# Altium schematic sheet QUTMS-TSAL2-S01.SchDoc: LED Driver
size A3; DrawnBy: Joseph Richards; DocumentNumber: 2; Revision: 2; SheetNumber: 3; SheetTotal: 3
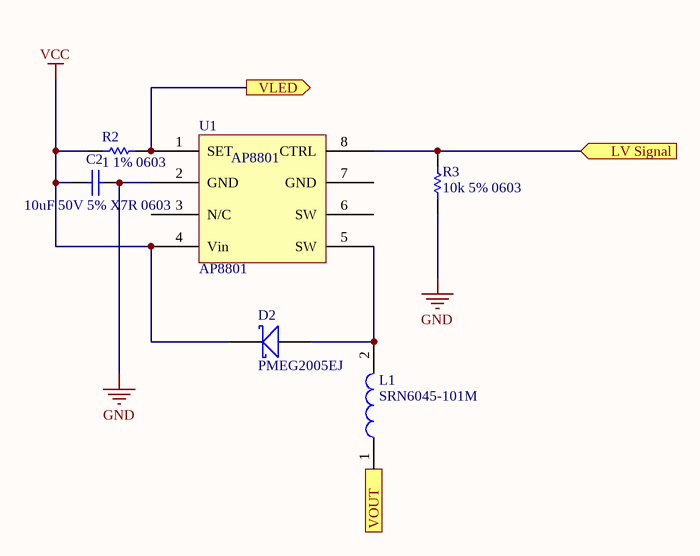
[diagram p0: QUTMS-TSAL2-S01.SchDoc]

## Parts
C2  10uF 50V 5% X7R 0603  [Cap_Ceramic_0603(10uf)]
D2  PMEG2005EJ  [SOD-323F(shottkey)]
L1  SRN6045-101M  [Bourns Inductor 6x6x4.5mm(100mH)]
R2  1 1% 0603  [Res_ThinFilm_0603 (1,10k)]
R3  10k 5% 0603  [Res_ThinFilm_0603 (1,10k)]
U1  AP8801  [SOP8/SO8(AP8801)]

## Ports
LV Signal (in), VLED (out), VOUT (in)

## Nets
GND: C2.2 R3.1 U1.2(GND)
VCC: C2.1 D2.K(Cathode) R2.1 U1.4(Vin)
LV Signal: R3.2 U1.8(CTRL) ; port LV Signal
VLED: R2.2 U1.1(SET) ; port VLED
VOUT: L1.1 ; port VOUT
NetD2_A: D2.A(Anode) L1.2 U1.5(SW)

Not connected (* = marked no-connect by the designer): U1 3(N/C) 6(SW) 7(GND)

## Notes on the sheet
- Revision History:
- Sheet Title:
- Rev
- Date
- Description
- Project:
- Size:
- Drawn By:
- A3
- Number:
- Revision:
- Sheet
- Version:
- of
- QUT Motorsport
- O-120, Gardens Point
- 2 George Street
- Brisbane, QLD 4000
- Australia
- Print Date:
- Print Time:
- File Name:

## Library data of the parts
C2 = 10uF 50V 5% X7R 0603: Capacitor, Ceramic, SMD, 10uF, 50V, 5%, X7R, 0603
D2 = PMEG2005EJ: Diode, Schottky, SMD, 20 V, 500 mA, Single, SOD-323F, 2 Pins, 390 mV; ComponentLink1Description: Element14; ComponentLink1URL: https://au.element14.com/nexperia/pmeg2005ej-115/schottky-rect-20v-0-5a-sod323f/dp/1757760
L1 = SRN6045-101M: Inductor, 100 µH, 700 mA, Semishielded, 800 mA, SRN6045 Series, 6mm x 6mm x 4.5mm; ComponentLink1Description: Element14; ComponentLink1URL: https://au.element14.com/bourns/srn6045-101m/inductor-100uh-semi-shielded-power/dp/2061658
R2 = 1 1% 0603: Resistor, SMD, 1, 0.1W, 1%, 0603
R3 = 10k 5% 0603: Resistor, SMD, 10k, 0.1W, 5%, 0603
U1 = AP8801: the LED drver fotr the red and green LED's